# EAGLE design driver_2 (EAGLE 7.2.0)
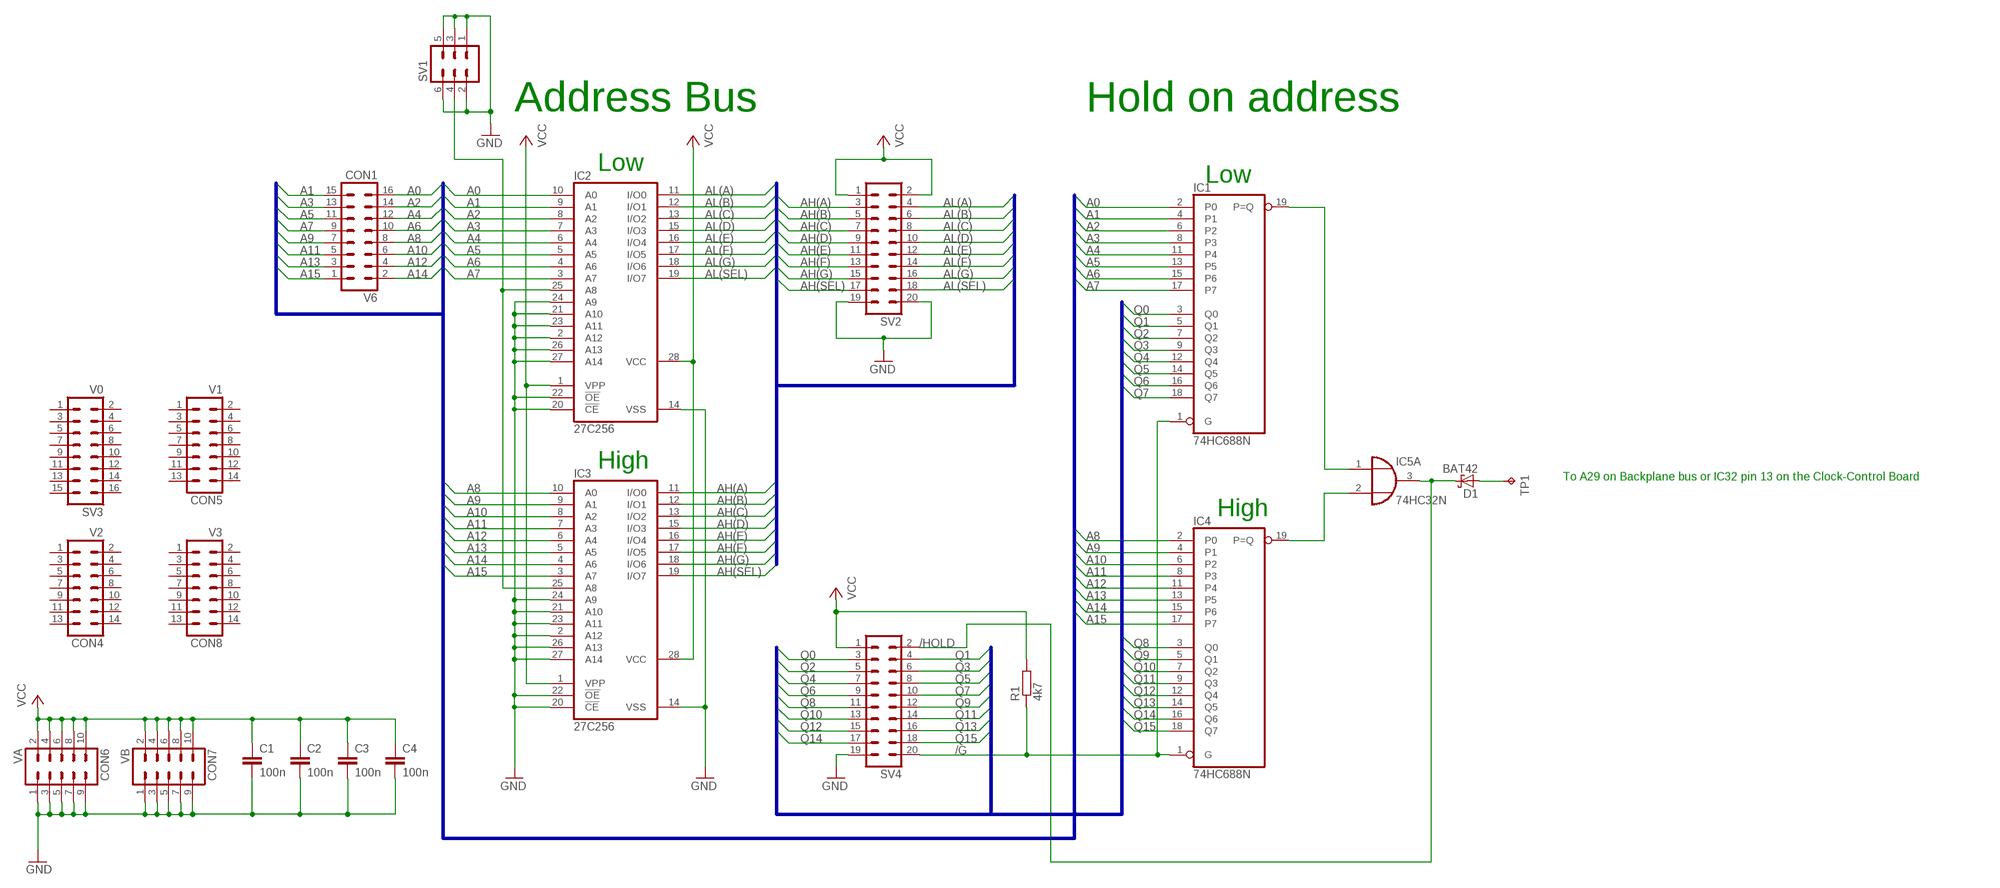
[diagram p0: schematic, sheet 1]

## Parts
C1  100n  C-EU050-024X044  [C050-024X044]
C2  100n  C-EU050-024X044  [C050-024X044]
C3  100n  C-EU050-024X044  [C050-024X044]
C4  100n  C-EU050-024X044  [C050-024X044]
CON1  V6  ML16  [ML16]
CON4  V2  ML14  [ML14]
CON5  V1  ML14  [ML14]
CON6  VA  ML10  [ML10]
CON7  VB  ML10  [ML10]
CON8  V3  ML14  [ML14]
D1  BAT42  [DO35-10]
IC1  74HC688N  [DIL20]
IC2  27C256  27C256AG  [DIL28-6]
IC3  27C256  27C256AG  [DIL28-6]
IC4  74HC688N  [DIL20]
IC5  74HC32N  [DIL14]
R1  4k7  R-EU_0204/5  [0204/5]
SV1  ML6  [ML6]
SV2  ML20L  [ML20L]
SV3  V0  ML16  [ML16]
SV4  ML20L  [ML20L]
TP1  Interface -> R12  TPPAD1-17  [P1-17]

## Nets
/G: IC1.1(G) IC4.1(G) R1.1 SV4.20
/HOLD: D1.C IC5.3(A:O) SV4.2
A0: CON1.16 IC1.2(P0) IC2.10(A0)
A1: CON1.15 IC1.4(P1) IC2.9(A1)
A2: CON1.14 IC1.6(P2) IC2.8(A2)
A3: CON1.13 IC1.8(P3) IC2.7(A3)
A4: CON1.12 IC1.11(P4) IC2.6(A4)
A5: CON1.11 IC1.13(P5) IC2.5(A5)
A6: CON1.10 IC1.15(P6) IC2.4(A6)
A7: CON1.9 IC1.17(P7) IC2.3(A7)
A8: CON1.8 IC3.10(A0) IC4.2(P0)
A9: CON1.7 IC3.9(A1) IC4.4(P1)
A10: CON1.6 IC3.8(A2) IC4.6(P2)
A11: CON1.5 IC3.7(A3) IC4.8(P3)
A12: CON1.4 IC3.6(A4) IC4.11(P4)
A13: CON1.3 IC3.5(A5) IC4.13(P5)
A14: CON1.2 IC3.4(A6) IC4.15(P6)
A15: CON1.1 IC3.3(A7) IC4.17(P7)
AH(A): IC3.11(I/O0) SV2.3
AH(B): IC3.12(I/O1) SV2.5
AH(C): IC3.13(I/O2) SV2.7
AH(D): IC3.15(I/O3) SV2.9
AH(E): IC3.16(I/O4) SV2.11
AH(F): IC3.17(I/O5) SV2.13
AH(G): IC3.18(I/O6) SV2.15
AH(SEL): IC3.19(I/O7) SV2.17
AL(A): IC2.11(I/O0) SV2.4
AL(B): IC2.12(I/O1) SV2.6
AL(C): IC2.13(I/O2) SV2.8
AL(D): IC2.15(I/O3) SV2.10
AL(E): IC2.16(I/O4) SV2.12
AL(F): IC2.17(I/O5) SV2.14
AL(G): IC2.18(I/O6) SV2.16
AL(SEL): IC2.19(I/O7) SV2.18
GND: C1.2 C2.2 C3.2 C4.2 CON6.1 CON6.3 CON6.5 CON6.7 CON6.9 CON7.1 CON7.3 CON7.5 CON7.7 CON7.9 IC2.2(A12) IC2.14(VSS) IC2.20(!CE) IC2.21(A10) IC2.22(!OE) IC2.23(A11) IC2.24(A9) IC2.26(A13) IC2.27(A14) IC3.2(A12) IC3.14(VSS) IC3.20(!CE) IC3.21(A10) IC3.22(!OE) IC3.23(A11) IC3.24(A9) IC3.26(A13) IC3.27(A14) SV1.1 SV1.2 SV1.3 SV1.5 SV1.6 SV2.19 SV2.20 SV4.19
N$2: IC2.25(A8) IC3.25(A8) SV1.4
N$3: IC1.19(P=Q) IC5.1(A:I0)
N$4: IC4.19(P=Q) IC5.2(A:I1)
N$5: D1.A TP1.TP
Q0: IC1.3(Q0) SV4.3
Q1: IC1.5(Q1) SV4.4
Q2: IC1.7(Q2) SV4.5
Q3: IC1.9(Q3) SV4.6
Q4: IC1.12(Q4) SV4.7
Q5: IC1.14(Q5) SV4.8
Q6: IC1.16(Q6) SV4.9
Q7: IC1.18(Q7) SV4.10
Q8: IC4.3(Q0) SV4.11
Q9: IC4.5(Q1) SV4.12
Q10: IC4.7(Q2) SV4.13
Q11: IC4.9(Q3) SV4.14
Q12: IC4.12(Q4) SV4.15
Q13: IC4.14(Q5) SV4.16
Q14: IC4.16(Q6) SV4.17
Q15: IC4.18(Q7) SV4.18
VCC: C1.1 C2.1 C3.1 C4.1 CON6.2 CON6.4 CON6.6 CON6.8 CON6.10 CON7.2 CON7.4 CON7.6 CON7.8 CON7.10 IC2.1(VPP) IC2.28(VCC) IC3.1(VPP) IC3.28(VCC) R1.2 SV2.1 SV2.2 SV4.1
Unconnected: CON4.1 CON4.2 CON4.3 CON4.4 CON4.5 CON4.6 CON4.7 CON4.8 CON4.9 CON4.10 CON4.11 CON4.12 CON4.13 CON4.14 CON5.1 CON5.2 CON5.3 CON5.4 CON5.5 CON5.6 CON5.7 CON5.8 CON5.9 CON5.10 CON5.11 CON5.12 CON5.13 CON5.14 CON8.1 CON8.2 CON8.3 CON8.4 CON8.5 CON8.6 CON8.7 CON8.8 CON8.9 CON8.10 CON8.11 CON8.12 CON8.13 CON8.14 IC5.4(B:I0) IC5.5(B:I1) IC5.6(B:O) IC5.8(C:O) IC5.9(C:I0) IC5.10(C:I1) IC5.11(D:O) IC5.12(D:I0) IC5.13(D:I1) SV3.1 SV3.2 SV3.3 SV3.4 SV3.5 SV3.6 SV3.7 SV3.8 SV3.9 SV3.10 SV3.11 SV3.12 SV3.13 SV3.14 SV3.15 SV3.16

## Buses
A[0..15]
AL(A),AL(B),AL(C),AL(D),AL(E),AL(F),AL(G),AL(SEL),AH(A),AH(B),AH(C),AH(D),AH(E),AH(F),AH(G),AH(SEL)
Q[0..15]

## Notes on the sheet
- Address Bus | Hold on address
- Low
- Low
- High
- To A29 on Backplane bus or IC32 pin 13 on the Clock-Control Board
- High

## Power pins joined to a net without a drawn wire
GND: IC1.10(GND) IC4.10(GND) IC5.7(P:GND)
VCC: IC1.20(VCC) IC4.20(VCC) IC5.14(P:VCC)

## Library data of the parts
C1-C4 = rcl:C-EU: CAPACITOR, European symbol
CON1 SV3 = con-ml:ML16: HARTING; OC_FARNELL: unknown; OC_NEWARK: unknown
CON4 CON5 CON8 = con-ml:ML14: HARTING; OC_FARNELL: unknown; OC_NEWARK: unknown
CON6 CON7 = con-ml:ML10: HARTING; OC_FARNELL: unknown; OC_NEWARK: unknown
D1 = diode:BAT42: DIODE barrier diode
IC1 IC4 = 74xx-eu:74*688: 8-bit MAGNITUDE/IDENTITY COMPARATOR, totem pole
IC2 IC3 = memory-hitachi:27C256AG: MEMORY; OC_FARNELL: unknown; OC_NEWARK: unknown
IC5 = 74xx-eu:74*32: Quad 2-input OR gate
R1 = rcl:R-EU_: RESISTOR, European symbol
SV1 = con-ml:ML6: HARTING; OC_FARNELL: unknown; OC_NEWARK: unknown
SV2 SV4 = con-ml:ML20L: HARTING; OC_FARNELL: unknown; OC_NEWARK: unknown
TP1 = testpad:TP: Test pad

## Board
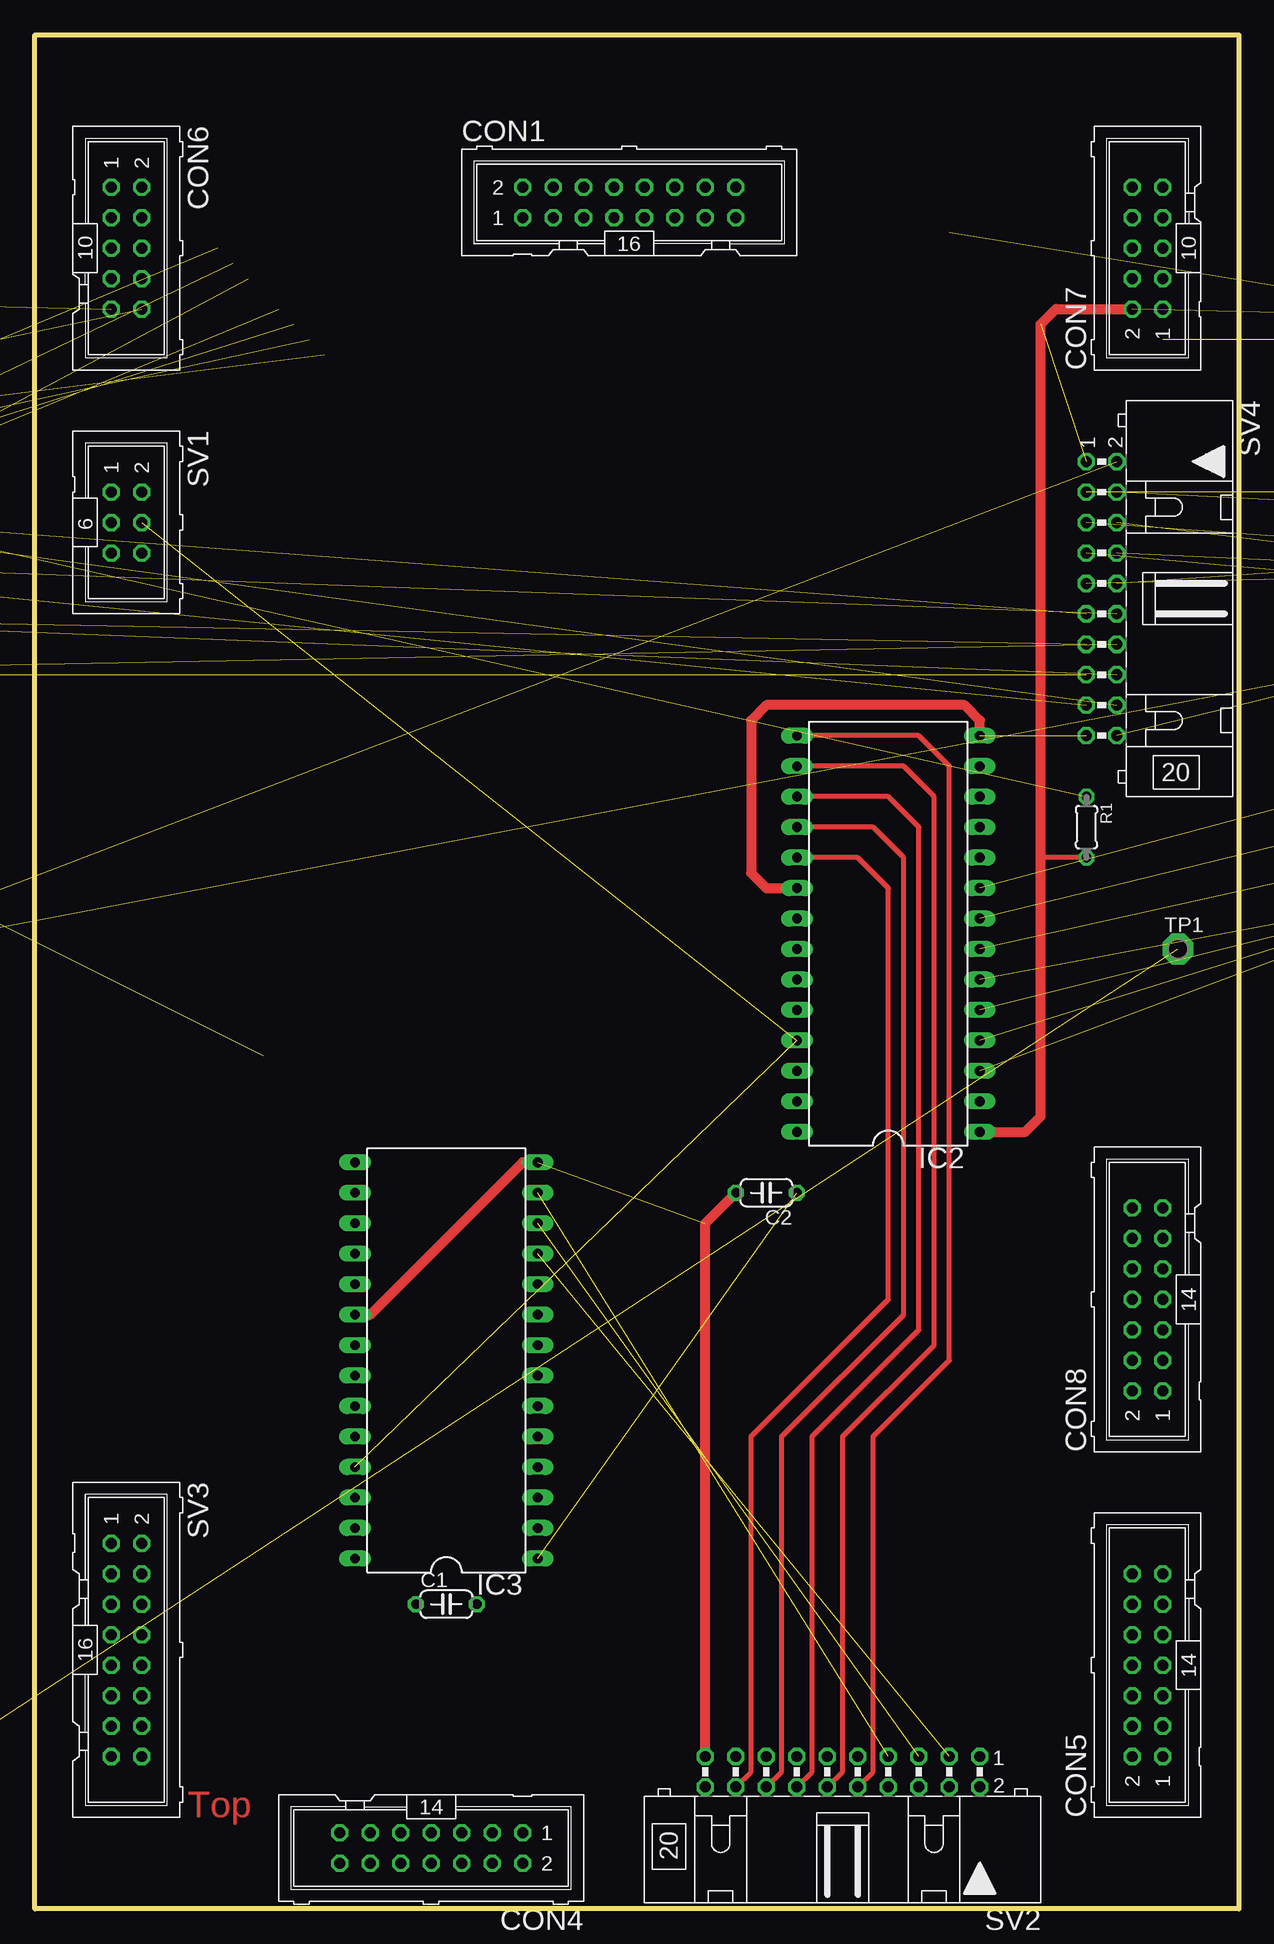
[diagram p1: board, top side]
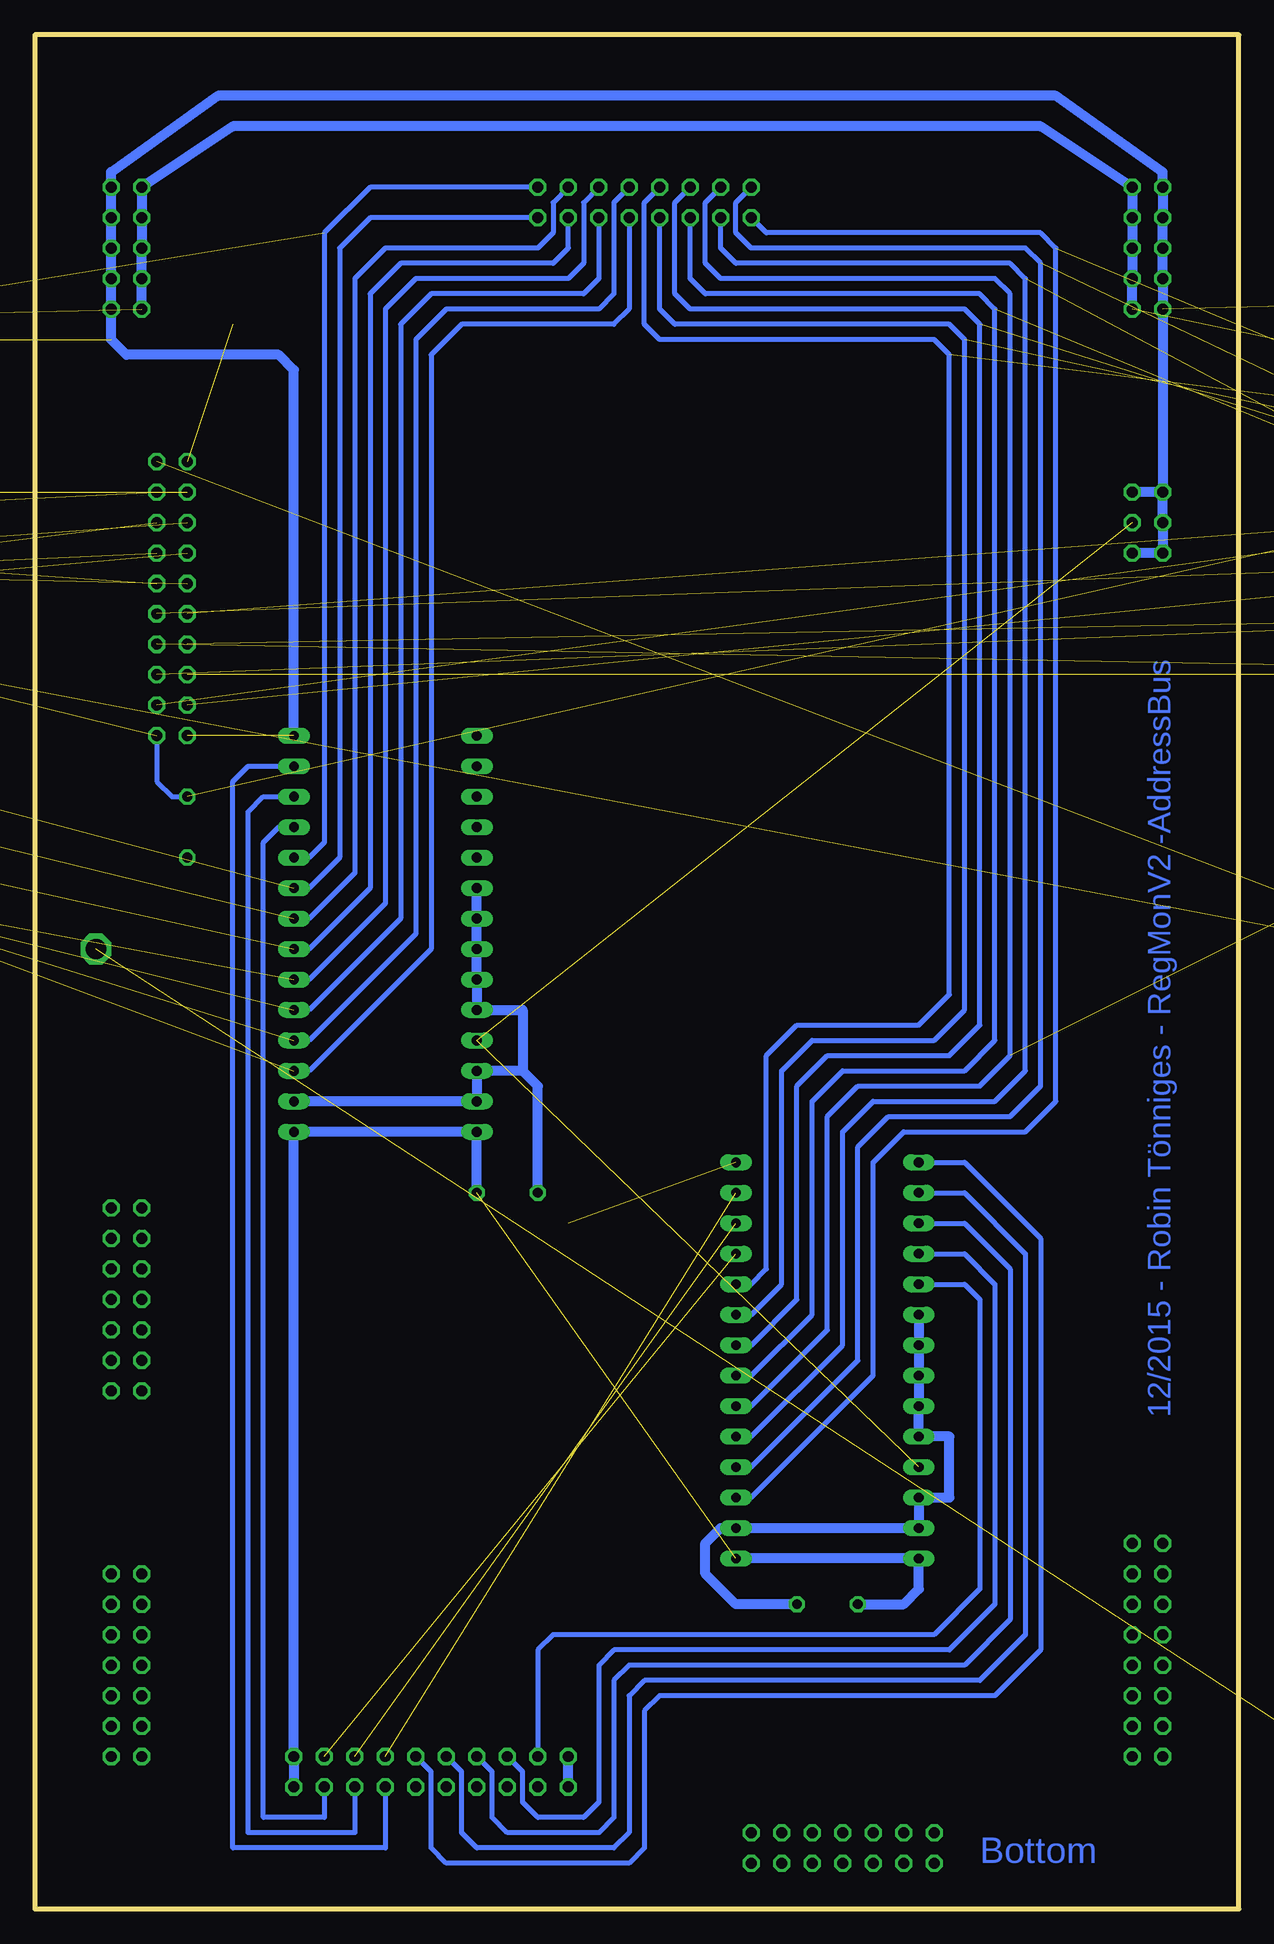
[diagram p2: board, bottom side, seen from below]

Size 100.33 x 156.21 mm. Coordinates in mm from the lower left corner, seen from the top.
Outline: 0,0 0,156.21 100.33,156.21 100.33,0 0,0
Copper layers (1*16): Top 0.035mm / dielectric 1.5mm / Bottom 0.035mm
Design rules "default": minimum track width 10mil, minimum drill 24mil, track to track 10mil, track to pad 20mil, pad to pad 8mil, via to via 8mil, smd to smd 8mil, copper to edge 40mil, drill to drill 8mil, minimum pad ring 10mil, minimum via ring 8mil, stop-mask expansion 4mil, vias tented up to drill 0mil, thermal gap 10mil

### Footprints (pad centres in the part's own frame; a part is rotated, then mirrored left to right if it is on the bottom)
C050-024X044 = drill 0.813 octagon: 1 -2.54,0; 2 2.54,0
ML16 = drill 0.914 octagon: 1 -8.89,-1.27; 2 -8.89,1.27; 3 -6.35,-1.27; 4 -6.35,1.27; 5 -3.81,-1.27; 6 -3.81,1.27; 7 -1.27,-1.27; 8 -1.27,1.27; 9 1.27,-1.27; 10 1.27,1.27; 11 3.81,-1.27; 12 3.81,1.27; 13 6.35,-1.27; 14 6.35,1.27; 15 8.89,-1.27; 16 8.89,1.27
ML14 = drill 0.914 octagon: 1 -7.62,-1.27; 2 -7.62,1.27; 3 -5.08,-1.27; 4 -5.08,1.27; 5 -2.54,-1.27; 6 -2.54,1.27; 7 0,-1.27; 8 0,1.27; 9 2.54,-1.27; 10 2.54,1.27; 11 5.08,-1.27; 12 5.08,1.27; 13 7.62,-1.27; 14 7.62,1.27
ML10 = drill 0.914 octagon: 1 -5.08,-1.27; 2 -5.08,1.27; 3 -2.54,-1.27; 4 -2.54,1.27; 5 0,-1.27; 6 0,1.27; 7 2.54,-1.27; 8 2.54,1.27; 9 5.08,-1.27; 10 5.08,1.27
DO35-10 = drill 0.813 long: A 5.08,0; C -5.08,0
DIL20 = drill 0.813 long: 1 -11.43,-3.81; 2 -8.89,-3.81; 3 -6.35,-3.81; 4 -3.81,-3.81; 5 -1.27,-3.81; 6 1.27,-3.81; 7 3.81,-3.81; 8 6.35,-3.81; 9 8.89,-3.81; 10 11.43,-3.81; 11 11.43,3.81; 12 8.89,3.81; 13 6.35,3.81; 14 3.81,3.81; 15 1.27,3.81; 16 -1.27,3.81; 17 -3.81,3.81; 18 -6.35,3.81; 19 -8.89,3.81; 20 -11.43,3.81
DIL28-6 = drill 0.813 long: 1 -16.51,-7.62; 2 -13.97,-7.62; 3 -11.43,-7.62; 4 -8.89,-7.62; 5 -6.35,-7.62; 6 -3.81,-7.62; 7 -1.27,-7.62; 8 1.27,-7.62; 9 3.81,-7.62; 10 6.35,-7.62; 11 8.89,-7.62; 12 11.43,-7.62; 13 13.97,-7.62; 14 16.51,-7.62; 15 16.51,7.62; 16 13.97,7.62; 17 11.43,7.62; 18 8.89,7.62; 19 6.35,7.62; 20 3.81,7.62; 21 1.27,7.62; 22 -1.27,7.62; 23 -3.81,7.62; 24 -6.35,7.62; 25 -8.89,7.62; 26 -11.43,7.62; 27 -13.97,7.62; 28 -16.51,7.62
DIL14 = drill 0.813 long: 1 -7.62,-3.81; 2 -5.08,-3.81; 3 -2.54,-3.81; 4 0,-3.81; 5 2.54,-3.81; 6 5.08,-3.81; 7 7.62,-3.81; 8 7.62,3.81; 9 5.08,3.81; 10 2.54,3.81; 11 0,3.81; 12 -2.54,3.81; 13 -5.08,3.81; 14 -7.62,3.81
0204/5 = drill 0.813 octagon: 1 -2.54,0; 2 2.54,0
ML6 = drill 0.914 octagon: 1 -2.54,-1.27; 2 -2.54,1.27; 3 0,-1.27; 4 0,1.27; 5 2.54,-1.27; 6 2.54,1.27
ML20L = drill 0.914 octagon: 1 -11.43,-1.27; 2 -11.43,1.27; 3 -8.89,-1.27; 4 -8.89,1.27; 5 -6.35,-1.27; 6 -6.35,1.27; 7 -3.81,-1.27; 8 -3.81,1.27; 9 -1.27,-1.27; 10 -1.27,1.27; 11 1.27,-1.27; 12 1.27,1.27; 13 3.81,-1.27; 14 3.81,1.27; 15 6.35,-1.27; 16 6.35,1.27; 17 8.89,-1.27; 18 8.89,1.27; 19 11.43,-1.27; 20 11.43,1.27
P1-17 = drill 1.702 pad 2.54 octagon: TP 0,0

### Placement (x,y rotation side)
C1  34.29,25.4 0 top
C2  60.96,59.69 180 top
C3  -45.72,134.62 180 top  (outside the outline)
C4  196.85,130.81 180 top  (outside the outline)
CON1  49.53,142.24 0 top
CON4  33.02,5.08 180 top
CON5  92.71,20.32 90 top
CON6  7.62,138.43 270 top
CON7  92.71,138.43 90 top
CON8  92.71,50.8 90 top
D1  -41.91,-6.35 0 top  (outside the outline)
IC1  196.85,111.76 270 top  (outside the outline)
IC2  71.12,81.28 90 top
IC3  34.29,45.72 90 top
IC4  -43.18,111.76 270 top  (outside the outline)
IC5  -41.91,66.04 270 top  (outside the outline)
R1  87.63,90.17 270 top
SV1  7.62,115.57 270 top
SV2  67.31,11.43 180 top
SV3  7.62,21.59 270 top
SV4  88.9,109.22 270 top
TP1  95.25,80.01 0 top

### Tracks (layer width: path | path; a pad name or v marks a point on that pad's centre or on a via)
/G  (2 unrouted)
  Bottom 0.406: SV4.20 90.17,93.98 88.9,92.71 R1.1
/HOLD  (2 unrouted)
A0  (1 unrouted)
  Bottom 0.406: CON1.16 72.39,143.51 76.2,139.7 76.2,88.9 77.47,87.63 IC2.10
A1  (1 unrouted)
  Bottom 0.406: CON1.15 72.39,140.97 74.93,138.43 74.93,87.63 77.47,85.09 IC2.9
A2  (1 unrouted)
  Bottom 0.406: CON1.14 57.15,142.24 57.15,139.7 58.42,138.43 71.12,138.43 73.66,135.89 73.66,86.36 77.47,82.55 IC2.8
A3  (1 unrouted)
  Bottom 0.406: IC2.7 77.47,80.01 72.39,85.09 72.39,134.62 69.85,137.16 57.15,137.16 55.88,138.43 CON1.13
A4  (1 unrouted)
  Bottom 0.406: CON1.12 54.61,142.24 54.61,137.16 55.88,135.89 68.58,135.89 71.12,133.35 71.12,83.82 77.47,77.47 IC2.6
A5  (1 unrouted)
  Bottom 0.406: CON1.11 53.34,135.89 54.61,134.62 67.31,134.62 69.85,132.08 69.85,82.55 77.47,74.93 IC2.5
A6  (1 unrouted)
  Bottom 0.406: CON1.10 52.07,142.24 52.07,134.62 53.34,133.35 66.04,133.35 68.58,130.81 68.58,81.28 77.47,72.39 IC2.4
A7  (1 unrouted)
  Bottom 0.406: CON1.9 50.8,133.35 52.07,132.08 64.77,132.08 67.31,129.54 67.31,80.01 77.47,69.85 IC2.3
A8  (1 unrouted)
  Bottom 0.406: IC3.10 40.64,52.07 39.37,53.34 39.37,71.12 36.83,73.66 26.67,73.66 24.13,76.2 24.13,129.54 25.4,130.81 48.26,130.81 49.53,132.08 49.53,142.24 CON1.8
A9  (1 unrouted)
  Bottom 0.406: IC3.9 40.64,49.53 38.1,52.07 38.1,69.85 35.56,72.39 25.4,72.39 22.86,74.93 22.86,130.81 24.13,132.08 46.99,132.08 48.26,133.35 CON1.7
A10  (1 unrouted)
  Bottom 0.406: IC3.8 40.64,46.99 36.83,50.8 36.83,68.58 34.29,71.12 24.13,71.12 21.59,73.66 21.59,132.08 22.86,133.35 45.72,133.35 46.99,134.62 46.99,142.24 CON1.6
A11  (1 unrouted)
  Bottom 0.406: IC3.7 40.64,44.45 35.56,49.53 35.56,67.31 33.02,69.85 22.86,69.85 20.32,72.39 20.32,133.35 21.59,134.62 44.45,134.62 45.72,135.89 CON1.5
A12  (1 unrouted)
  Bottom 0.406: IC3.6 40.64,41.91 34.29,48.26 34.29,66.04 31.75,68.58 21.59,68.58 19.05,71.12 19.05,134.62 20.32,135.89 43.18,135.89 44.45,137.16 44.45,142.24 CON1.4
A13  (1 unrouted)
  Bottom 0.406: IC3.5 40.64,39.37 33.02,46.99 33.02,64.77 30.48,67.31 20.32,67.31 17.78,69.85 17.78,135.89 19.05,137.16 41.91,137.16 43.18,138.43 CON1.3
A14  (1 unrouted)
  Bottom 0.406: IC3.4 40.64,36.83 31.75,45.72 31.75,63.5 29.21,66.04 19.05,66.04 16.51,68.58 16.51,137.16 17.78,138.43 40.64,138.43 41.91,139.7 41.91,142.24 CON1.2
A15  (1 unrouted)
  Bottom 0.406: IC3.3 40.64,34.29 30.48,44.45 30.48,62.23 27.94,64.77 17.78,64.77 15.24,67.31 15.24,138.43 16.51,139.7 39.37,139.7 CON1.1
AH(A)  (1 unrouted)
AH(B)  (1 unrouted)
AH(C)  (1 unrouted)
AH(D)
  Bottom 0.406: IC3.15 22.86,62.23 16.51,55.88 16.51,21.59 20.32,17.78 48.26,17.78 49.53,16.51 49.53,5.08 50.8,3.81 66.04,3.81 67.31,5.08 67.31,11.43 SV2.9
AH(E)
  Bottom 0.406: IC3.16 22.86,59.69 17.78,54.61 17.78,22.86 21.59,19.05 49.53,19.05 50.8,17.78 50.8,6.35 52.07,5.08 63.5,5.08 64.77,6.35 64.77,11.43 SV2.11
AH(F)
  Bottom 0.406: IC3.17 22.86,57.15 19.05,53.34 19.05,24.13 22.86,20.32 50.8,20.32 52.07,19.05 52.07,7.62 53.34,6.35 60.96,6.35 62.23,7.62 62.23,11.43 SV2.13
AH(G)
  Bottom 0.406: IC3.18 22.86,54.61 20.32,52.07 20.32,25.4 24.13,21.59 52.07,21.59 53.34,20.32 53.34,8.89 54.61,7.62 58.42,7.62 59.69,8.89 59.69,11.43 SV2.15
AH(SEL)
  Bottom 0.406: IC3.19 22.86,52.07 21.59,50.8 21.59,26.67 25.4,22.86 57.15,22.86 58.42,21.59 SV2.17
AL(A)
  Bottom 0.406: SV2.4 76.2,7.62 81.28,7.62 81.28,88.9 80.01,90.17 IC2.11
AL(B)
  Bottom 0.406: SV2.6 73.66,6.35 82.55,6.35 82.55,91.44 81.28,92.71 IC2.12
AL(C)
  Bottom 0.406: SV2.8 71.12,5.08 83.82,5.08 83.82,93.98 82.55,95.25 IC2.13
AL(D)
  Top 0.406: SV2.10 69.85,11.43 69.85,39.37 76.2,45.72 76.2,95.25 73.66,97.79 IC2.15
AL(E)
  Top 0.406: SV2.12 67.31,11.43 67.31,39.37 74.93,46.99 74.93,92.71 72.39,95.25 IC2.16
AL(F)
  Top 0.406: SV2.14 64.77,11.43 64.77,39.37 73.66,48.26 73.66,90.17 71.12,92.71 IC2.17
AL(G)
  Top 0.406: SV2.16 62.23,11.43 62.23,39.37 72.39,49.53 72.39,87.63 69.85,90.17 IC2.18
AL(SEL)
  Top 0.406: SV2.18 59.69,11.43 59.69,39.37 71.12,50.8 71.12,85.09 68.58,87.63 IC2.19
GND  (7 unrouted)
  Top 0.813: SV2.19 55.88,57.15 C2.2 | IC3.20 27.94,49.53 40.64,62.23 IC3.14 | IC2.14 78.74,99.06 77.47,100.33 60.96,100.33 59.69,99.06 59.69,86.36 60.96,85.09 IC2.20
  Bottom 0.813: SV1.1 CON6.9 CON6.7 CON6.5 CON6.3 CON6.1 6.35,144.78 15.24,151.13 85.09,151.13 93.98,144.78 CON7.9 CON7.7 CON7.5 CON7.3 CON7.1 93.98,130.81 92.71,129.54 80.01,129.54 78.74,128.27 IC2.14 | SV1.1 SV1.3 SV1.5 SV1.6 | SV1.1 SV1.2 | SV2.20 SV2.19 | IC3.20 IC3.21 IC3.22 IC3.23 IC3.24 24.13,39.37 24.13,34.29 IC3.26 IC3.27 IC3.2 43.18,31.75 44.45,30.48 44.45,27.94 41.91,25.4 C1.2 | IC2.2 IC2.27 IC2.26 59.69,69.85 | 59.69,69.85 59.69,74.93 IC2.24 IC2.23 IC2.22 IC2.21 IC2.20 | C2.2 58.42,68.58 59.69,69.85
N$1
  Bottom 0.406: 0,0 0,156.21 100.33,156.21 100.33,0 0,0
N$2  (2 unrouted)
N$3  (1 unrouted)
N$4  (1 unrouted)
N$5  (1 unrouted)
Q0  (1 unrouted)
Q1  (1 unrouted)
Q2  (1 unrouted)
Q3  (1 unrouted)
Q4  (1 unrouted)
Q5  (1 unrouted)
Q6  (1 unrouted)
Q7  (1 unrouted)
Q8  (1 unrouted)
Q9  (1 unrouted)
Q10  (1 unrouted)
Q11  (1 unrouted)
Q12  (1 unrouted)
Q13  (1 unrouted)
Q14  (1 unrouted)
Q15  (1 unrouted)
VCC  (7 unrouted)
  Top 0.406: R1.2 83.82,87.63
  Top 0.813: IC2.1 82.55,64.77 83.82,66.04 83.82,87.63 83.82,132.08 85.09,133.35 CON7.2
  Bottom 0.813: CON6.10 CON6.8 CON6.6 CON6.4 CON6.2 16.51,148.59 83.82,148.59 CON7.10 CON7.8 CON7.6 CON7.4 CON7.2 | SV2.2 SV2.1 IC2.1 IC2.28 C2.1 | IC3.1 IC3.28 26.67,26.67 27.94,25.4 C1.1

### Text on the board
Top: Top
Bottom: 12/2015 - Robin Tönniges - RegMonV2 -AddressBus | Bottom